# EAGLE schematic ConnectionBoard (EAGLE 5.06)
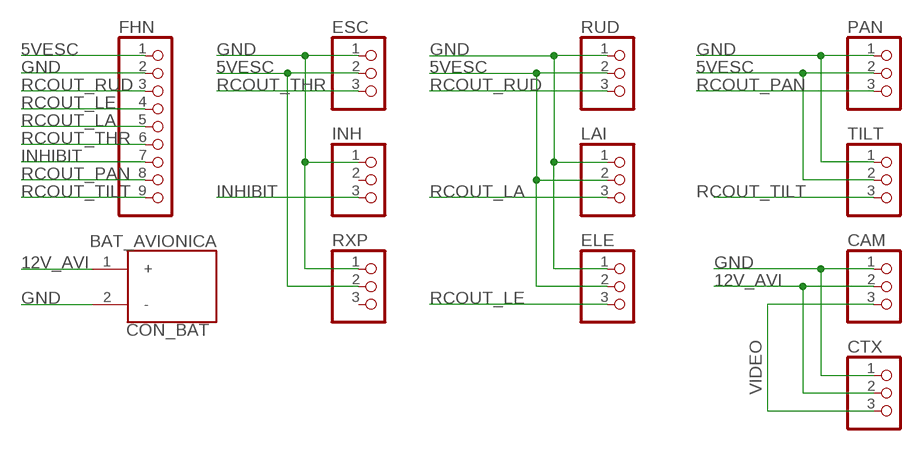
[diagram p0: schematic, sheet 1]

## Parts
BAT_AVIONICA  CON_BAT  [CON_BAT]
CAM  PINHD-1X3  [1X03]
CTX  PINHD-1X3  [1X03]
ELE  PINHD-1X3  [1X03]
ESC  PINHD-1X3  [1X03]
FHN  PINHD-1X9  [1X09]
INH  PINHD-1X3  [1X03]
LAI  PINHD-1X3  [1X03]
PAN  PINHD-1X3  [1X03]
RUD  PINHD-1X3  [1X03]
RXP  PINHD-1X3  [1X03]
TILT  PINHD-1X3  [1X03]

## Nets
5VESC: ELE.2 ESC.2 FHN.1 LAI.2 PAN.2 RUD.2 RXP.2 TILT.2
12V_AVI: BAT_AVIONICA.1(+) CAM.2 CTX.2
GND: BAT_AVIONICA.2(-) CAM.1 CTX.1 ELE.1 ESC.1 FHN.2 INH.1 LAI.1 PAN.1 RUD.1 RXP.1 TILT.1
INHIBIT: FHN.7 INH.3
N$3: CAM.3 CTX.3
RCOUT_LA: FHN.5 LAI.3
RCOUT_LE: ELE.3 FHN.4
RCOUT_PAN: FHN.8 PAN.3
RCOUT_RUD: FHN.3 RUD.3
RCOUT_THR: ESC.3 FHN.6
RCOUT_TILT: FHN.9 TILT.3
Unconnected: INH.2 RXP.3

## Notes on the sheet
- VIDEO

## Library data of the parts
BAT_AVIONICA = Conector bateria:CON_BAT
CAM CTX ELE ESC INH LAI PAN RUD RXP TILT = pinhead:PINHD-1X3: PIN HEADER
FHN = pinhead:PINHD-1X9: PIN HEADER